# Altium schematic sheet OPK_XEM7310_BRKOUT.SchDoc
size Tabloid; SheetNumber: 6; SheetTotal: 9
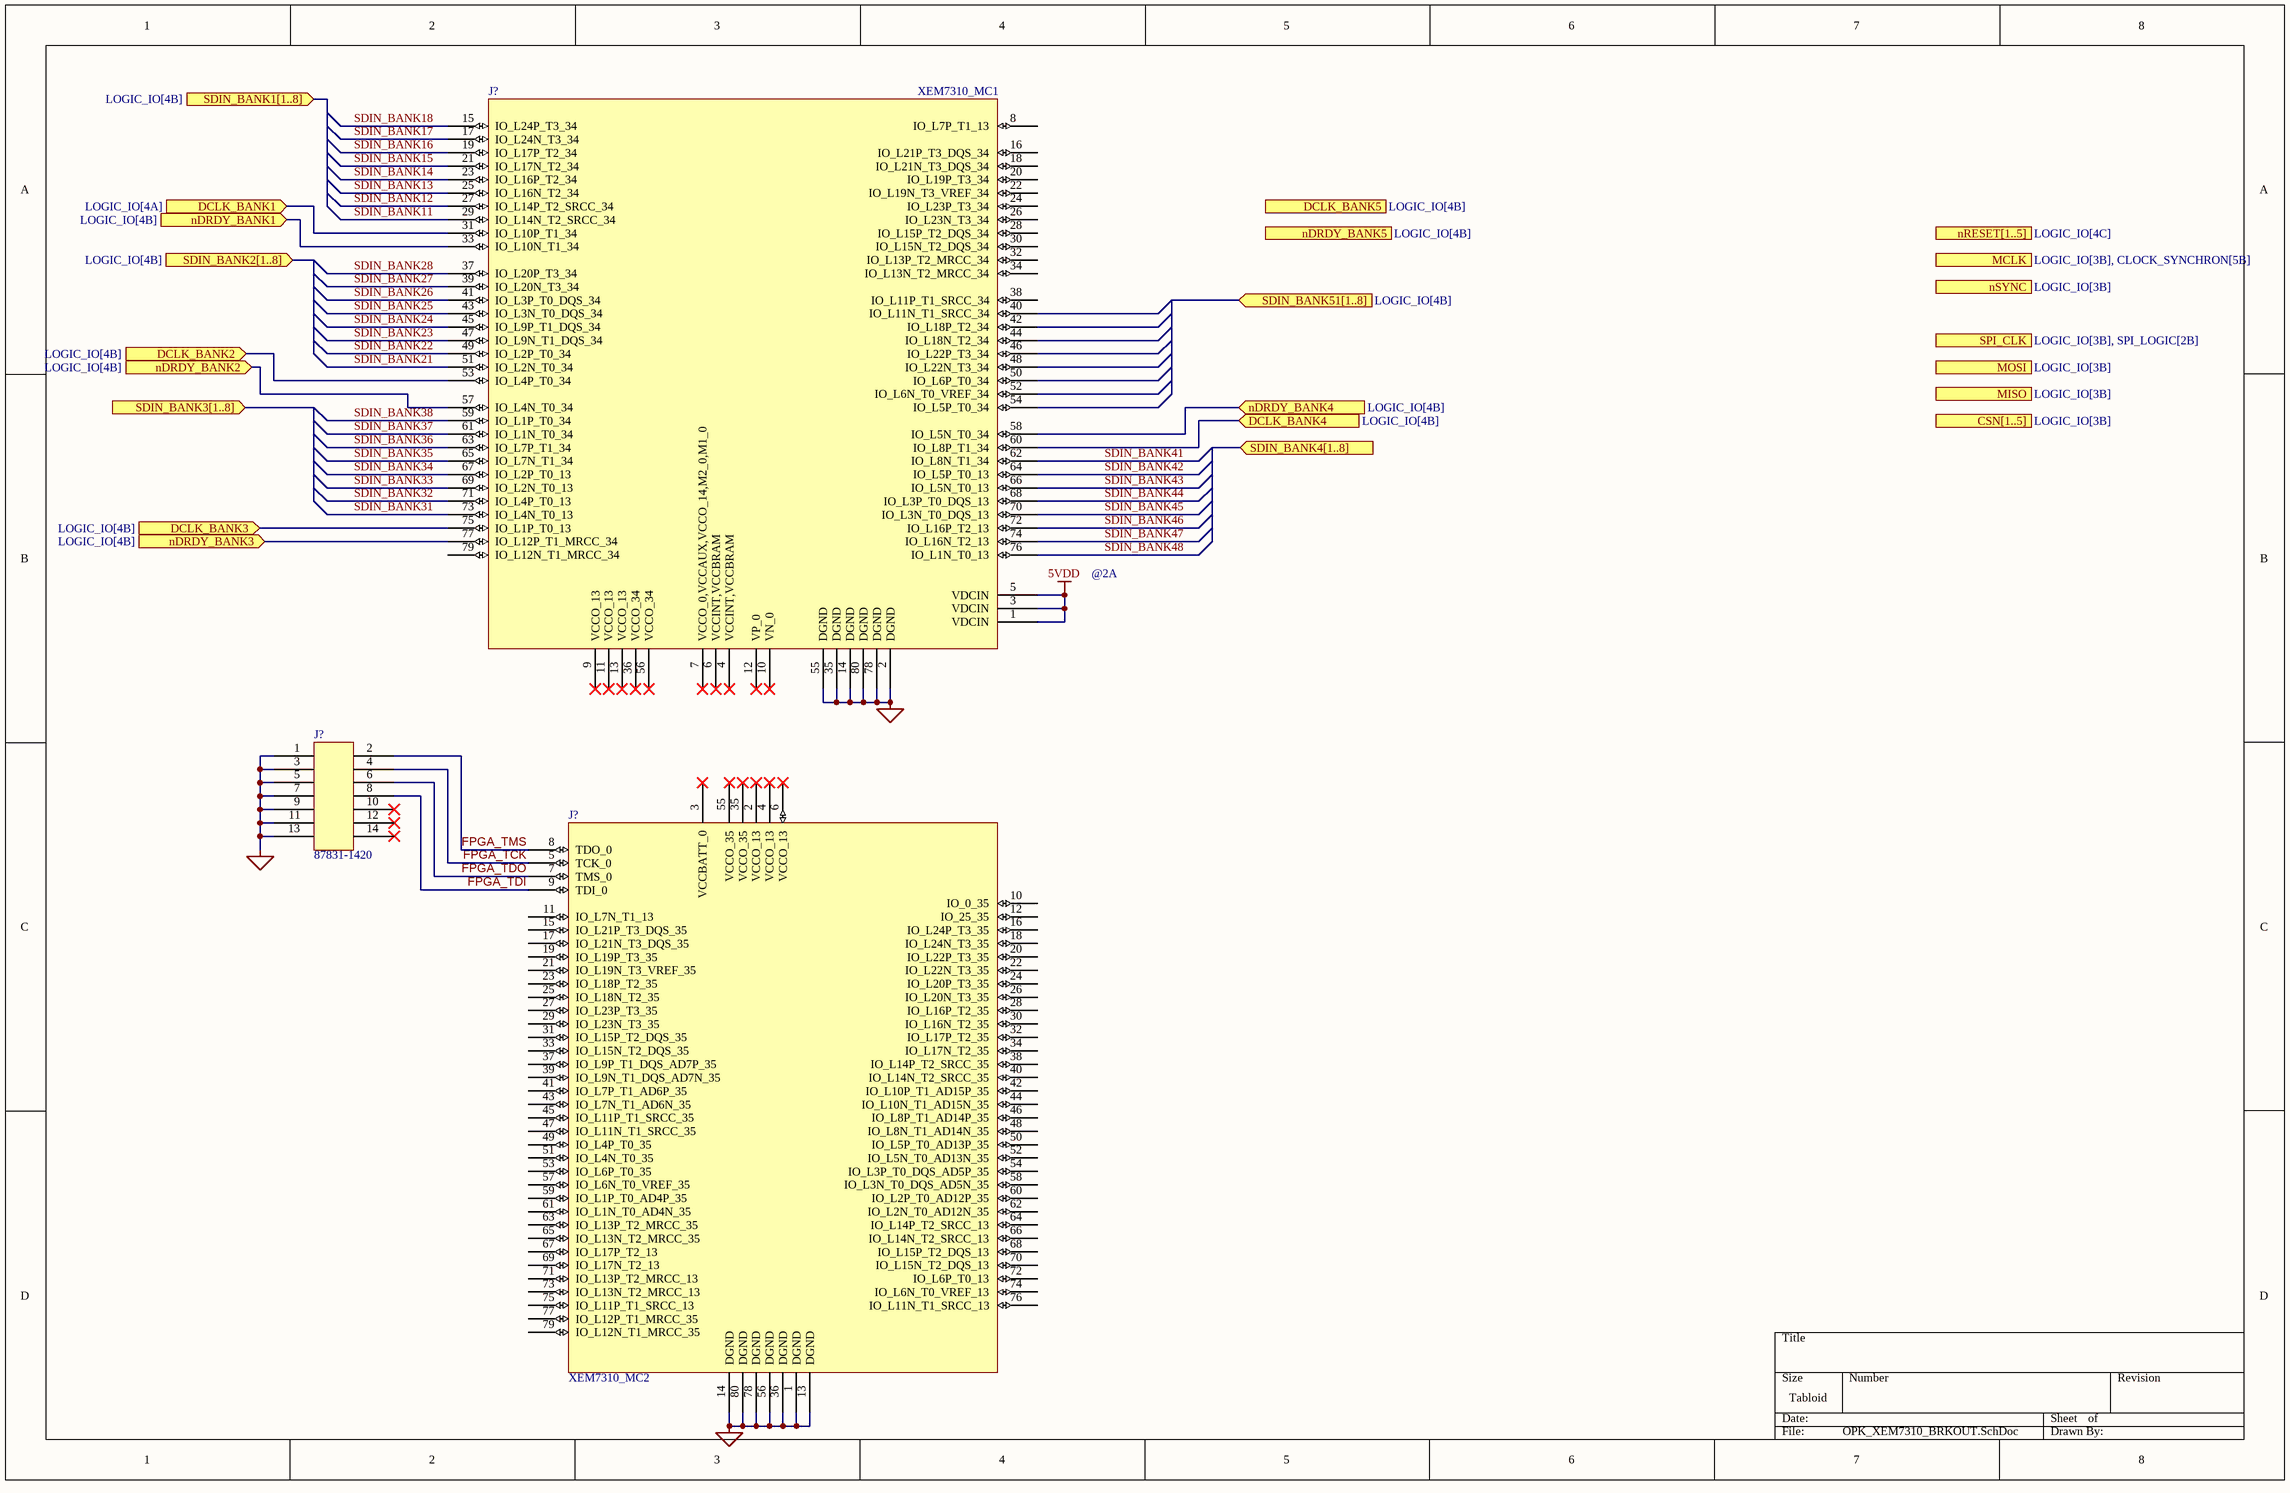
[diagram p0: OPK_XEM7310_BRKOUT.SchDoc]

## Parts
(Parts that share a designator on the sheet are numbered #1, #2 ... from top to bottom, then left to right.)
J?#1  XEM7310_MC1  [BTE-040]
J?#2  87831-1420  [HDR2X7-2MM]
J?#3  XEM7310_MC2  [BTE-040]

## Ports
CSN[1..5] (out, see LOGIC_IO[3B]), DCLK_BANK1 (in, see LOGIC_IO[4A]), DCLK_BANK2 (in, see LOGIC_IO[4B]), DCLK_BANK3 (in, see LOGIC_IO[4B]), DCLK_BANK4 (in, see LOGIC_IO[4B]), DCLK_BANK5 (in, see LOGIC_IO[4B]), MCLK (out, see LOGIC_IO[3B], CLOCK_SYNCHRON[5B]), MISO (in, see LOGIC_IO[3B]), MOSI (out, see LOGIC_IO[3B]), nDRDY_BANK1 (in, see LOGIC_IO[4B]), nDRDY_BANK2 (in, see LOGIC_IO[4B]), nDRDY_BANK3 (in, see LOGIC_IO[4B]), nDRDY_BANK4 (in, see LOGIC_IO[4B]), nDRDY_BANK5 (in, see LOGIC_IO[4B]), nRESET[1..5] (out, see LOGIC_IO[4C]), nSYNC (out, see LOGIC_IO[3B]), SDIN_BANK1[1..8] (in, see LOGIC_IO[4B]), SDIN_BANK2[1..8] (in, see LOGIC_IO[4B]), SDIN_BANK3[1..8] (in), SDIN_BANK4[1..8] (in), SDIN_BANK51[1..8] (in, see LOGIC_IO[4B]), SPI_CLK (out, see LOGIC_IO[3B], SPI_LOGIC[2B])

## Nets
5VDD: J?#1.1(VDCIN) J?#1.3(VDCIN) J?#1.5(VDCIN)
GND: J?#1.2(DGND) J?#1.14(DGND) J?#1.35(DGND) J?#1.55(DGND) J?#1.78(DGND) J?#1.80(DGND) J?#2.1 J?#2.3 J?#2.5 J?#2.7 J?#2.9 J?#2.11 J?#2.13 J?#3.1(DGND) J?#3.13(DGND) J?#3.14(DGND) J?#3.36(DGND) J?#3.56(DGND) J?#3.78(DGND) J?#3.80(DGND)
DCLK_BANK1: J?#1.31(IO_L10P_T1_34) ; port DCLK_BANK1
DCLK_BANK2: J?#1.53(IO_L4P_T0_34) ; port DCLK_BANK2
DCLK_BANK3: J?#1.75(IO_L1P_T0_13) ; port DCLK_BANK3
DCLK_BANK4: J?#1.60(IO_L8P_T1_34) ; port DCLK_BANK4
FPGA_TCK: J?#2.4 J?#3.5(TCK_0)
FPGA_TDI: J?#2.8 J?#3.9(TDI_0)
FPGA_TDO: J?#2.6 J?#3.7(TMS_0)
FPGA_TMS: J?#2.2 J?#3.8(TDO_0)
nDRDY_BANK1: J?#1.33(IO_L10N_T1_34) ; port nDRDY_BANK1
nDRDY_BANK2: J?#1.57(IO_L4N_T0_34) ; port nDRDY_BANK2
nDRDY_BANK3: J?#1.77(IO_L12P_T1_MRCC_34) ; port nDRDY_BANK3
nDRDY_BANK4: J?#1.58(IO_L5N_T0_34) ; port nDRDY_BANK4
SDIN_BANK11: J?#1.29(IO_L14N_T2_SRCC_34)
SDIN_BANK12: J?#1.27(IO_L14P_T2_SRCC_34)
SDIN_BANK13: J?#1.25(IO_L16N_T2_34)
SDIN_BANK14: J?#1.23(IO_L16P_T2_34)
SDIN_BANK15: J?#1.21(IO_L17N_T2_34)
SDIN_BANK16: J?#1.19(IO_L17P_T2_34)
SDIN_BANK17: J?#1.17(IO_L24N_T3_34)
SDIN_BANK18: J?#1.15(IO_L24P_T3_34)
SDIN_BANK21: J?#1.51(IO_L2N_T0_34)
SDIN_BANK22: J?#1.49(IO_L2P_T0_34)
SDIN_BANK23: J?#1.47(IO_L9N_T1_DQS_34)
SDIN_BANK24: J?#1.45(IO_L9P_T1_DQS_34)
SDIN_BANK25: J?#1.43(IO_L3N_T0_DQS_34)
SDIN_BANK26: J?#1.41(IO_L3P_T0_DQS_34)
SDIN_BANK27: J?#1.39(IO_L20N_T3_34)
SDIN_BANK28: J?#1.37(IO_L20P_T3_34)
SDIN_BANK31: J?#1.73(IO_L4N_T0_13)
SDIN_BANK32: J?#1.71(IO_L4P_T0_13)
SDIN_BANK33: J?#1.69(IO_L2N_T0_13)
SDIN_BANK34: J?#1.67(IO_L2P_T0_13)
SDIN_BANK35: J?#1.65(IO_L7N_T1_34)
SDIN_BANK36: J?#1.63(IO_L7P_T1_34)
SDIN_BANK37: J?#1.61(IO_L1N_T0_34)
SDIN_BANK38: J?#1.59(IO_L1P_T0_34)
SDIN_BANK41: J?#1.62(IO_L8N_T1_34)
SDIN_BANK42: J?#1.64(IO_L5P_T0_13)
SDIN_BANK43: J?#1.66(IO_L5N_T0_13)
SDIN_BANK44: J?#1.68(IO_L3P_T0_DQS_13)
SDIN_BANK45: J?#1.70(IO_L3N_T0_DQS_13)
SDIN_BANK46: J?#1.72(IO_L16P_T2_13)
SDIN_BANK47: J?#1.74(IO_L16N_T2_13)
SDIN_BANK48: J?#1.76(IO_L1N_T0_13)

Not connected (* = marked no-connect by the designer): J?#1 4(VCCINT,VCCBRAM)* 6(VCCINT,VCCBRAM)* 7(VCCO_0,VCCAUX,VCCO_14,M2_0,M1_0)* 8(IO_L7P_T1_13) 9(VCCO_13)* 10(VN_0)* 11(VCCO_13)* 12(VP_0)* 13(VCCO_13)* 16(IO_L21P_T3_DQS_34) 18(IO_L21N_T3_DQS_34) 20(IO_L19P_T3_34) 22(IO_L19N_T3_VREF_34) 24(IO_L23P_T3_34) 26(IO_L23N_T3_34) 28(IO_L15P_T2_DQS_34) 30(IO_L15N_T2_DQS_34) 32(IO_L13P_T2_MRCC_34) 34(IO_L13N_T2_MRCC_34) 36(VCCO_34)* 38(IO_L11P_T1_SRCC_34) 40(IO_L11N_T1_SRCC_34) 42(IO_L18P_T2_34) 44(IO_L18N_T2_34) 46(IO_L22P_T3_34) 48(IO_L22N_T3_34) 50(IO_L6P_T0_34) 52(IO_L6N_T0_VREF_34) 54(IO_L5P_T0_34) 56(VCCO_34)* 79(IO_L12N_T1_MRCC_34); J?#2 10* 12* 14*; J?#3 2(VCCO_13)* 3(VCCBATT_0)* 4(VCCO_13)* 6(VCCO_13)* 10(IO_0_35) 11(IO_L7N_T1_13) 12(IO_25_35) 15(IO_L21P_T3_DQS_35) 16(IO_L24P_T3_35) 17(IO_L21N_T3_DQS_35) 18(IO_L24N_T3_35) 19(IO_L19P_T3_35) 20(IO_L22P_T3_35) 21(IO_L19N_T3_VREF_35) 22(IO_L22N_T3_35) 23(IO_L18P_T2_35) 24(IO_L20P_T3_35) 25(IO_L18N_T2_35) 26(IO_L20N_T3_35) 27(IO_L23P_T3_35) 28(IO_L16P_T2_35) 29(IO_L23N_T3_35) 30(IO_L16N_T2_35) 31(IO_L15P_T2_DQS_35) 32(IO_L17P_T2_35) 33(IO_L15N_T2_DQS_35) 34(IO_L17N_T2_35) 35(VCCO_35)* 37(IO_L9P_T1_DQS_AD7P_35) 38(IO_L14P_T2_SRCC_35) 39(IO_L9N_T1_DQS_AD7N_35) 40(IO_L14N_T2_SRCC_35) 41(IO_L7P_T1_AD6P_35) 42(IO_L10P_T1_AD15P_35) 43(IO_L7N_T1_AD6N_35) 44(IO_L10N_T1_AD15N_35) 45(IO_L11P_T1_SRCC_35) 46(IO_L8P_T1_AD14P_35) 47(IO_L11N_T1_SRCC_35) 48(IO_L8N_T1_AD14N_35) 49(IO_L4P_T0_35) 50(IO_L5P_T0_AD13P_35) 51(IO_L4N_T0_35) 52(IO_L5N_T0_AD13N_35) 53(IO_L6P_T0_35) 54(IO_L3P_T0_DQS_AD5P_35) 55(VCCO_35)* 57(IO_L6N_T0_VREF_35) 58(IO_L3N_T0_DQS_AD5N_35) 59(IO_L1P_T0_AD4P_35) 60(IO_L2P_T0_AD12P_35) 61(IO_L1N_T0_AD4N_35) 62(IO_L2N_T0_AD12N_35) 63(IO_L13P_T2_MRCC_35) 64(IO_L14P_T2_SRCC_13) 65(IO_L13N_T2_MRCC_35) 66(IO_L14N_T2_SRCC_13) 67(IO_L17P_T2_13) 68(IO_L15P_T2_DQS_13) 69(IO_L17N_T2_13) 70(IO_L15N_T2_DQS_13) 71(IO_L13P_T2_MRCC_13) 72(IO_L6P_T0_13) 73(IO_L13N_T2_MRCC_13) 74(IO_L6N_T0_VREF_13) 75(IO_L11P_T1_SRCC_13) 76(IO_L11N_T1_SRCC_13) 77(IO_L12P_T1_MRCC_35) 79(IO_L12N_T1_MRCC_35)

## Notes on the sheet
- @2A

## Library data of the parts
J?#1 = XEM7310_MC1: OPK XEM7310 MC1 Connector, 1/2
J?#2 = JTAG-CONN: JTAG breakout, 2mm pitch
J?#3 = XEM7310_MC2: OPK XEM7310 MC2 Connector, 2/2